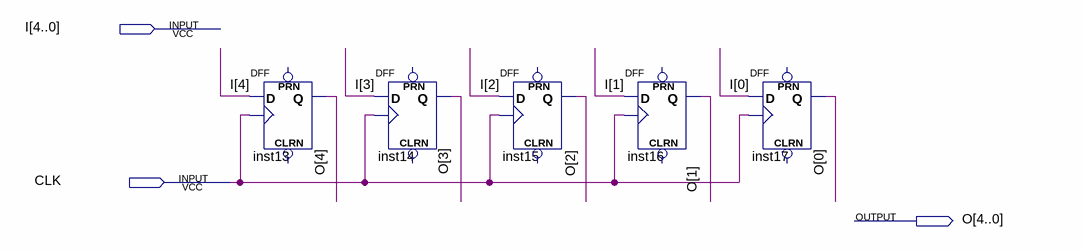
[diagram p0: schematic sheet]
// Quartus schematic Reg1x5.bdf as structural Verilog: 5 symbols, 3 pins
module Reg1x5 (
  input  [4:0] I,
  input  CLK,
  output [4:0] O
);

  DFF inst13 (.CLK(CLK), .D(I[4]), .Q(O[4]));  // open: CLRN, PRN
  DFF inst14 (.CLK(CLK), .D(I[3]), .Q(O[3]));  // open: CLRN, PRN
  DFF inst15 (.CLK(CLK), .D(I[2]), .Q(O[2]));  // open: CLRN, PRN
  DFF inst16 (.CLK(CLK), .D(I[1]), .Q(O[1]));  // open: CLRN, PRN
  DFF inst17 (.CLK(CLK), .D(I[0]), .Q(O[0]));  // open: CLRN, PRN
endmodule
